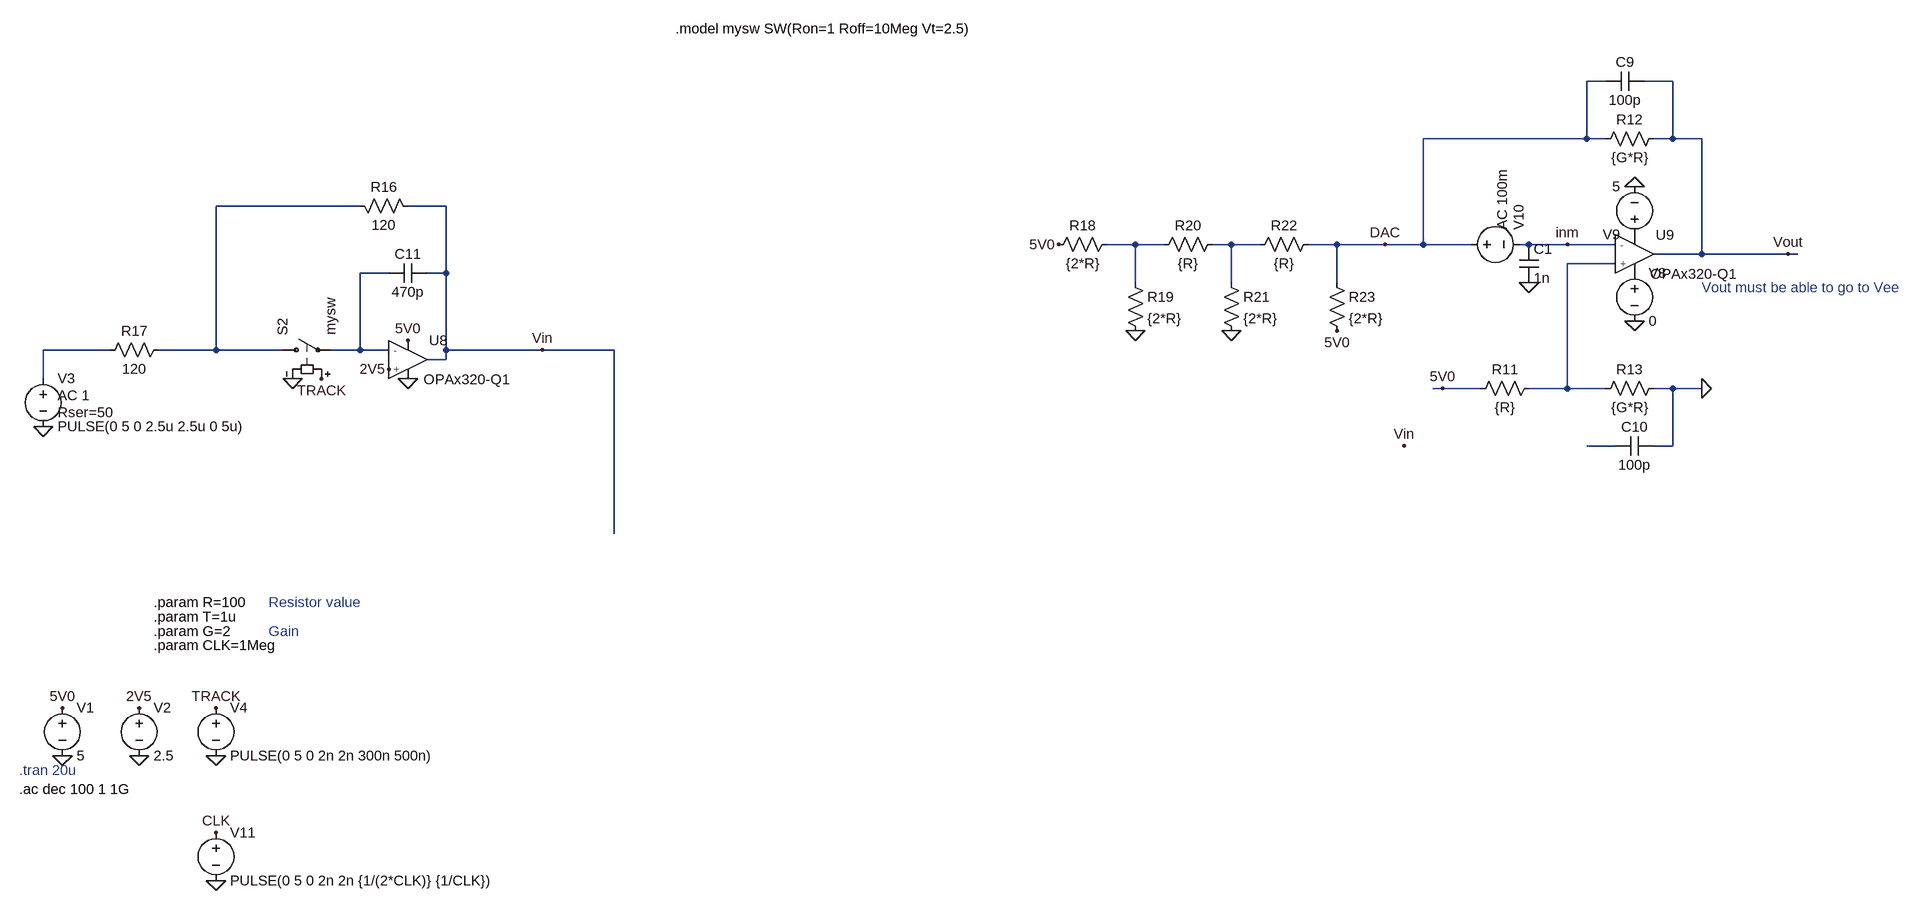
[diagram p0: schematic ADCnDAC_PhaseMargin.asc]
ADCnDAC_PhaseMargin.asc, the LTspice schematic file:
Version 4.1
SHEET 1 4800 904
WIRE 3264 -1024 3232 -1024
WIRE 3376 -1024 3328 -1024
WIRE 3232 -928 3232 -1024
WIRE 3232 -928 2960 -928
WIRE 3264 -928 3232 -928
WIRE 3376 -928 3376 -1024
WIRE 3376 -928 3344 -928
WIRE 3424 -928 3376 -928
WIRE 592 -816 352 -816
WIRE 736 -816 672 -816
WIRE 2480 -752 2432 -752
WIRE 2528 -752 2480 -752
WIRE 2640 -752 2608 -752
WIRE 2688 -752 2640 -752
WIRE 2816 -752 2768 -752
WIRE 2896 -752 2816 -752
WIRE 2960 -752 2960 -928
WIRE 2960 -752 2896 -752
WIRE 3040 -752 2960 -752
WIRE 3136 -752 3120 -752
WIRE 3200 -752 3136 -752
WIRE 3280 -752 3200 -752
WIRE 3424 -736 3424 -928
WIRE 3424 -736 3344 -736
WIRE 3568 -736 3424 -736
WIRE 3584 -736 3568 -736
WIRE 3280 -720 3200 -720
WIRE 640 -704 592 -704
WIRE 736 -704 736 -816
WIRE 736 -704 704 -704
WIRE 2480 -688 2480 -752
WIRE 2640 -688 2640 -752
WIRE 2816 -688 2816 -752
WIRE 176 -576 64 -576
WIRE 352 -576 352 -816
WIRE 352 -576 256 -576
WIRE 464 -576 352 -576
WIRE 592 -576 592 -704
WIRE 592 -576 544 -576
WIRE 640 -576 592 -576
WIRE 736 -576 736 -704
WIRE 896 -576 736 -576
WIRE 1072 -576 896 -576
WIRE 736 -560 736 -576
WIRE 736 -560 704 -560
WIRE 64 -528 64 -576
WIRE 2992 -512 2976 -512
WIRE 3056 -512 2992 -512
WIRE 3200 -512 3200 -720
WIRE 3200 -512 3136 -512
WIRE 3264 -512 3200 -512
WIRE 3376 -512 3344 -512
WIRE 3424 -512 3376 -512
WIRE 3280 -416 3232 -416
WIRE 3376 -416 3376 -512
WIRE 3376 -416 3344 -416
WIRE 1072 -256 1072 -576
FLAG 224 336 0
FLAG 96 336 0
FLAG 96 256 5V0
FLAG 224 256 2V5
FLAG 64 -448 0
FLAG 896 -576 Vin
FLAG 2928 -416 Vin
FLAG 3568 -736 Vout
FLAG 3312 -624 0
FLAG 3312 -848 0
FLAG 2896 -752 DAC
FLAG 352 336 0
FLAG 352 256 TRACK
FLAG 2992 -512 5V0
FLAG 3424 -512 0
FLAG 352 544 0
FLAG 352 464 CLK
FLAG 672 -528 0
FLAG 672 -592 5V0
FLAG 480 -528 0
FLAG 528 -528 TRACK
FLAG 640 -544 2V5
FLAG 2640 -608 0
FLAG 2480 -608 0
FLAG 3200 -752 inm
FLAG 2352 -752 5V0
FLAG 2816 -608 5V0
FLAG 3136 -688 0
SYMBOL voltage 96 240 R0
WINDOW 123 0 0 Left 0
WINDOW 39 0 0 Left 0
SYMATTR InstName V1
SYMATTR Value 5
SYMBOL voltage 224 240 R0
WINDOW 123 0 0 Left 0
WINDOW 39 0 0 Left 0
SYMATTR InstName V2
SYMATTR Value 2.5
SYMBOL voltage 64 -544 R0
WINDOW 123 24 44 Left 2
WINDOW 39 24 72 Left 2
SYMATTR Value2 AC 1
SYMATTR SpiceLine Rser=50
SYMATTR InstName V3
SYMATTR Value PULSE(0 5 0 2.5u 2.5u 0 5u)
SYMBOL res 2448 -768 R90
WINDOW 0 0 56 VBottom 2
WINDOW 3 32 56 VTop 2
SYMATTR InstName R18
SYMATTR Value {2*R}
SYMBOL res 2464 -704 R0
SYMATTR InstName R19
SYMATTR Value {2*R}
SYMBOL res 2624 -768 R90
WINDOW 0 0 56 VBottom 2
WINDOW 3 32 56 VTop 2
SYMATTR InstName R20
SYMATTR Value {R}
SYMBOL res 2624 -704 R0
SYMATTR InstName R21
SYMATTR Value {2*R}
SYMBOL res 2784 -768 R90
WINDOW 0 0 56 VBottom 2
WINDOW 3 32 56 VTop 2
SYMATTR InstName R22
SYMATTR Value {R}
SYMBOL res 2800 -704 R0
SYMATTR InstName R23
SYMATTR Value {2*R}
SYMBOL res 3152 -528 R90
WINDOW 0 0 56 VBottom 2
WINDOW 3 32 56 VTop 2
SYMATTR InstName R11
SYMATTR Value {R}
SYMBOL res 3360 -944 R90
WINDOW 0 0 56 VBottom 2
WINDOW 3 32 56 VTop 2
SYMATTR InstName R12
SYMATTR Value {G*R}
SYMBOL voltage 3312 -720 R0
WINDOW 123 0 0 Left 0
WINDOW 39 0 0 Left 0
SYMATTR InstName V8
SYMATTR Value 0
SYMBOL voltage 3312 -752 R180
WINDOW 123 0 0 Left 0
WINDOW 39 0 0 Left 0
SYMATTR InstName V9
SYMATTR Value 5
SYMBOL res 3360 -528 R90
WINDOW 0 0 56 VBottom 2
WINDOW 3 32 56 VTop 2
SYMATTR InstName R13
SYMATTR Value {G*R}
SYMBOL voltage 352 240 R0
WINDOW 123 0 0 Left 0
WINDOW 39 0 0 Left 0
SYMATTR InstName V4
SYMATTR Value PULSE(0 5 0 2n 2n 300n 500n)
SYMBOL voltage 3024 -752 R270
WINDOW 0 24 96 Left 2
WINDOW 3 24 16 Left 2
WINDOW 123 24 68 Left 2
WINDOW 39 0 0 Left 0
SYMATTR InstName V10
SYMATTR Value ""
SYMATTR Value2 AC 100m
SYMBOL cap 3328 -1040 R90
WINDOW 0 0 32 VBottom 2
WINDOW 3 32 32 VTop 2
SYMATTR InstName C9
SYMATTR Value 100p
SYMBOL cap 3344 -432 R90
WINDOW 0 0 32 VBottom 2
WINDOW 3 32 32 VTop 2
SYMATTR InstName C10
SYMATTR Value 100p
SYMBOL voltage 352 448 R0
WINDOW 123 0 0 Left 0
WINDOW 39 0 0 Left 0
SYMATTR InstName V11
SYMATTR Value PULSE(0 5 0 2n 2n {1/(2*CLK)} {1/CLK})
SYMBOL cap 640 -720 M90
WINDOW 0 0 32 VBottom 2
WINDOW 3 32 32 VTop 2
SYMATTR InstName C11
SYMATTR Value 470p
SYMBOL res 576 -832 M90
WINDOW 0 0 56 VBottom 2
WINDOW 3 32 56 VTop 2
SYMATTR InstName R16
SYMATTR Value 120
SYMBOL sw 448 -576 R270
SYMATTR InstName S2
SYMATTR Value mysw
SYMBOL res 272 -592 R90
WINDOW 0 0 56 VBottom 2
WINDOW 3 32 56 VTop 2
SYMATTR InstName R17
SYMATTR Value 120
SYMBOL OPAx320-Q1 704 -560 R0
SYMATTR InstName U8
SYMBOL OPAx320-Q1 3344 -736 R0
SYMATTR InstName U9
SYMBOL cap 3120 -752 R0
SYMATTR InstName C1
SYMATTR Value 1n
TEXT 248 80 Left 2 !.param R=100
TEXT 24 360 Left 2 ;.tran 20u
TEXT 248 104 Left 2 !.param T=1u
TEXT 3424 -680 Left 2 ;Vout must be able to go to Vee
TEXT 248 128 Left 2 !.param G=2
TEXT 440 80 Left 2 ;Resistor value
TEXT 440 128 Left 2 ;Gain
TEXT 1240 -1112 Left 2 !.model mysw SW(Ron=1 Roff=10Meg Vt=2.5)
TEXT 248 152 Left 2 !.param CLK=1Meg
TEXT 24 392 Left 2 !.ac dec 100 1 1G

The netlist it stands for:
* ADCnDAC_PhaseMargin.asc
V1 5V0 0 5
V2 2V5 0 2.5
V3 N006 0 PULSE(0 5 0 2.5u 2.5u 0 5u) AC 1 Rser=50
R18 N002 5V0 {2*R}
R19 N002 0 {2*R}
R20 N003 N002 {R}
R21 N003 0 {2*R}
R22 DAC N003 {R}
R23 DAC 5V0 {2*R}
R11 N004 5V0 {R}
R12 Vout DAC {G*R}
V8 P001 0 0
V9 P002 0 5
R13 0 N004 {G*R}
V4 TRACK 0 PULSE(0 5 0 2n 2n 300n 500n)
V10 DAC inm AC 100m
C9 Vout DAC 100p
C10 0 N007 100p
V11 CLK 0 PULSE(0 5 0 2n 2n {1/(2*CLK)} {1/CLK})
C11 N005 Vin 470p
R16 N001 Vin 120
S2 N001 N005 TRACK 0 mysw
R17 N001 N006 120
X§U8 2V5 N005 5V0 0 Vin OPAx320-Q1  ; pins + - VCC VEE OUT
X§U9 N004 inm P002 P001 Vout OPAx320-Q1  ; pins + - VCC VEE OUT
C1 inm 0 1n
.param R=100
* .tran 20u
.param T=1u
* Vout must be able to go to Vee
.param G=2
* Resistor value
* Gain
.model mysw SW(Ron=1 Roff=10Meg Vt=2.5)
.param CLK=1Meg
.ac dec 100 1 1G
.lib D:\Personal Projects\Pipelined-ADC\Simulations\SampleAndHold\OPAx320-Q1.LIB
.backanno
.end